# EasyEDA Pro project motoko_ice_dragon_x.eprj, schematic Schematic1

## Sheets
1 main: Board Name: Board1; Create Date: 2026-04-26; Page Name: main; Project Name: motoko_ice_dragon_x; Schematic Name: Schematic1; Update Date: 2026-04-30; Company: EasyEDA.com; Page Size: A4; Version: V1.0
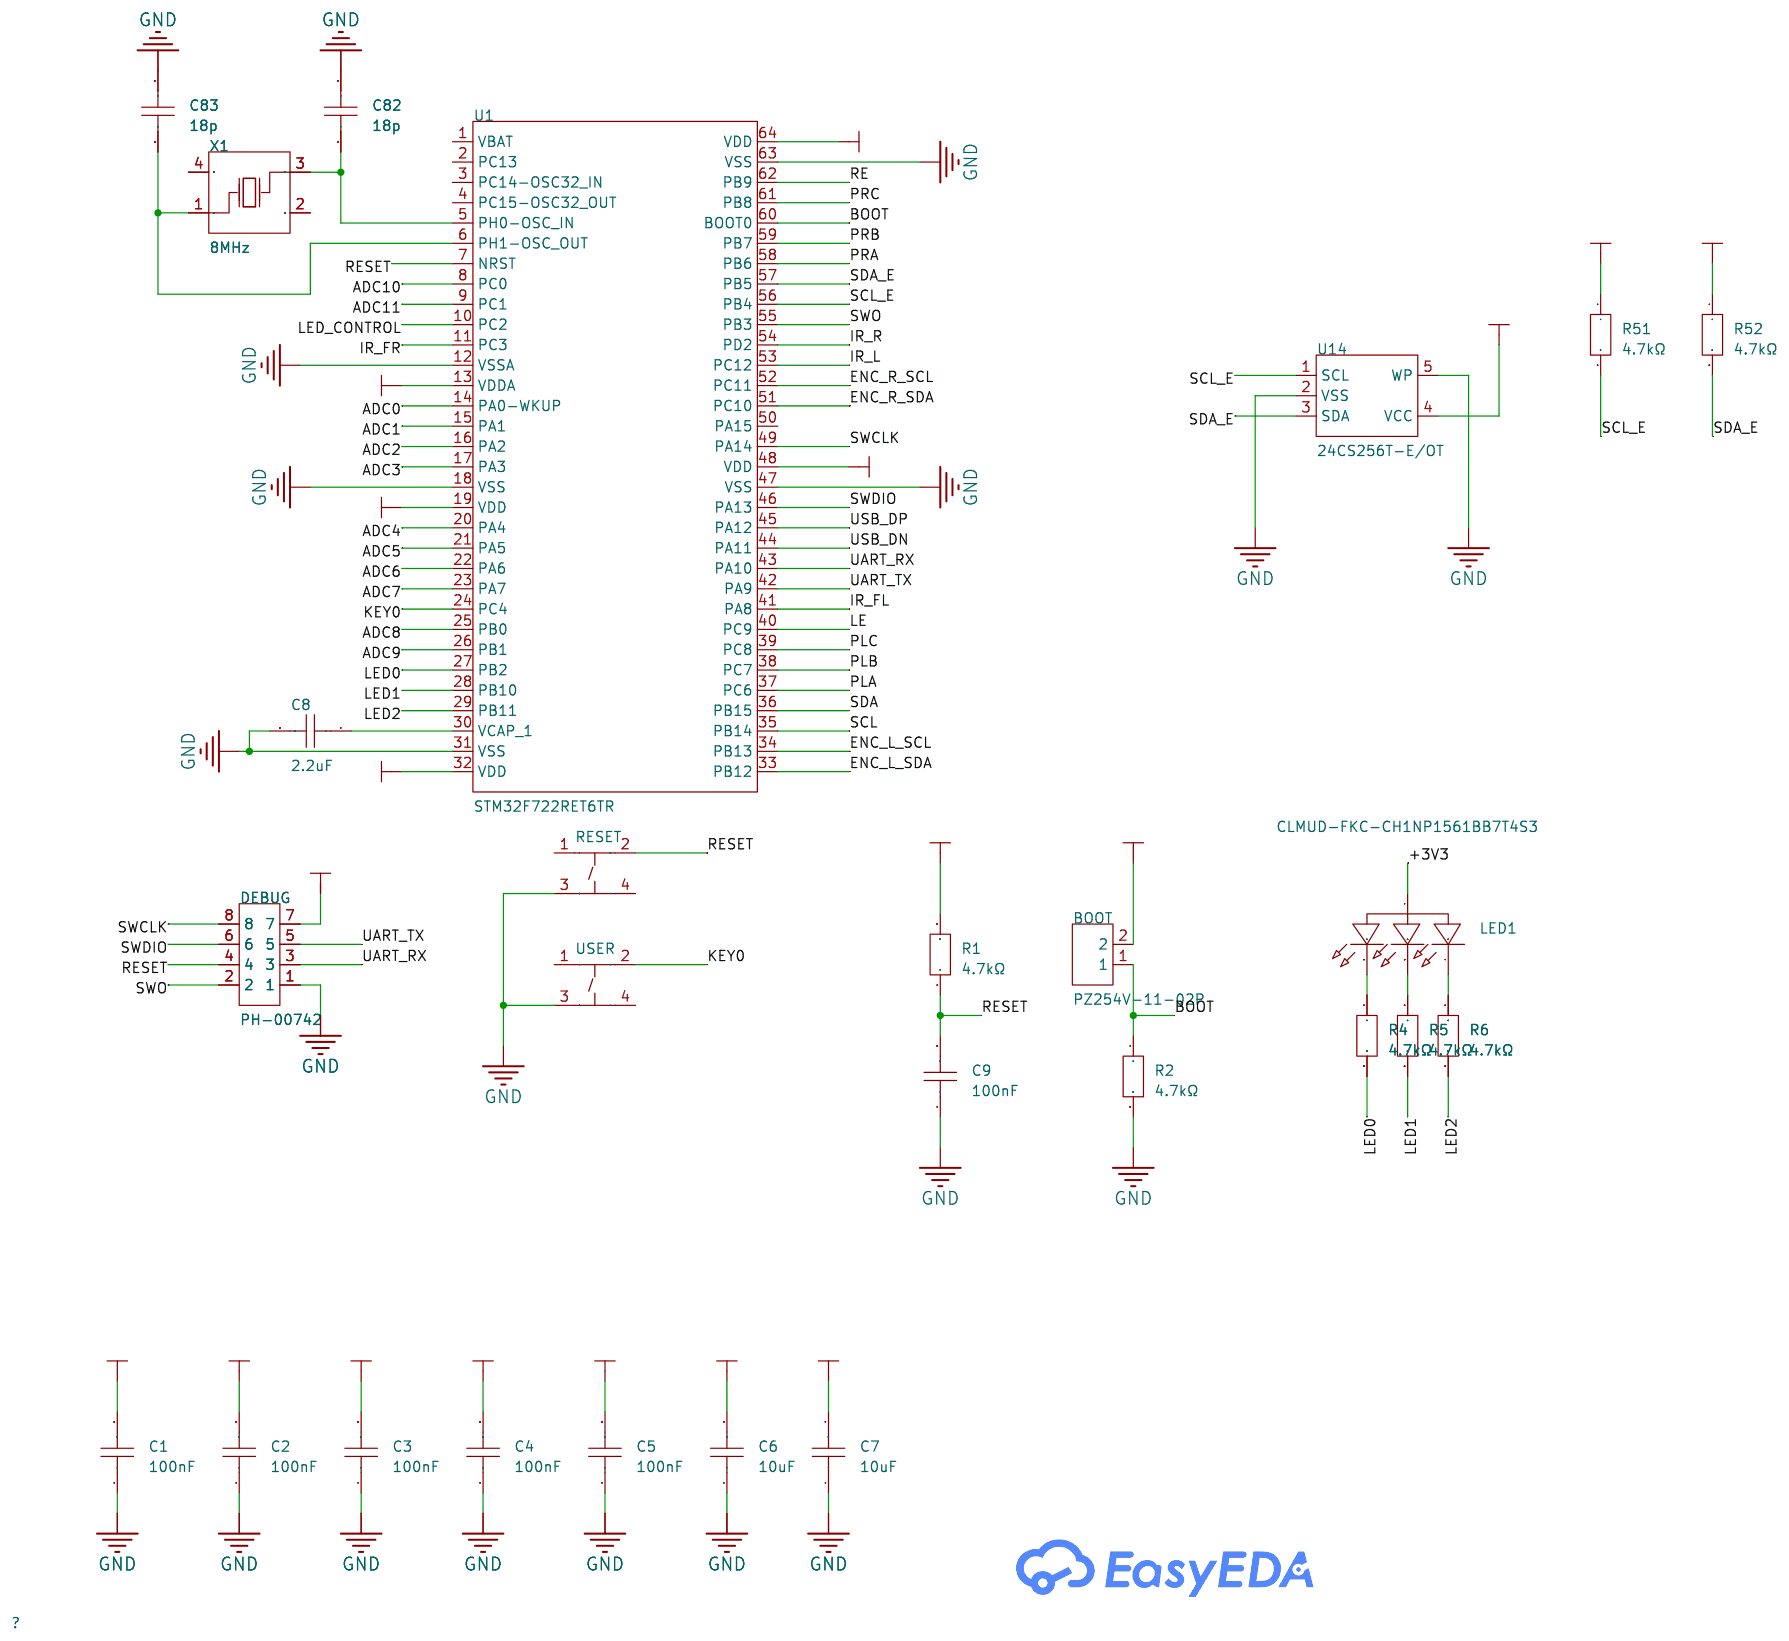
[diagram p0: main]
2 sensors: Page Name: sensors; Update Date: 2026-04-28
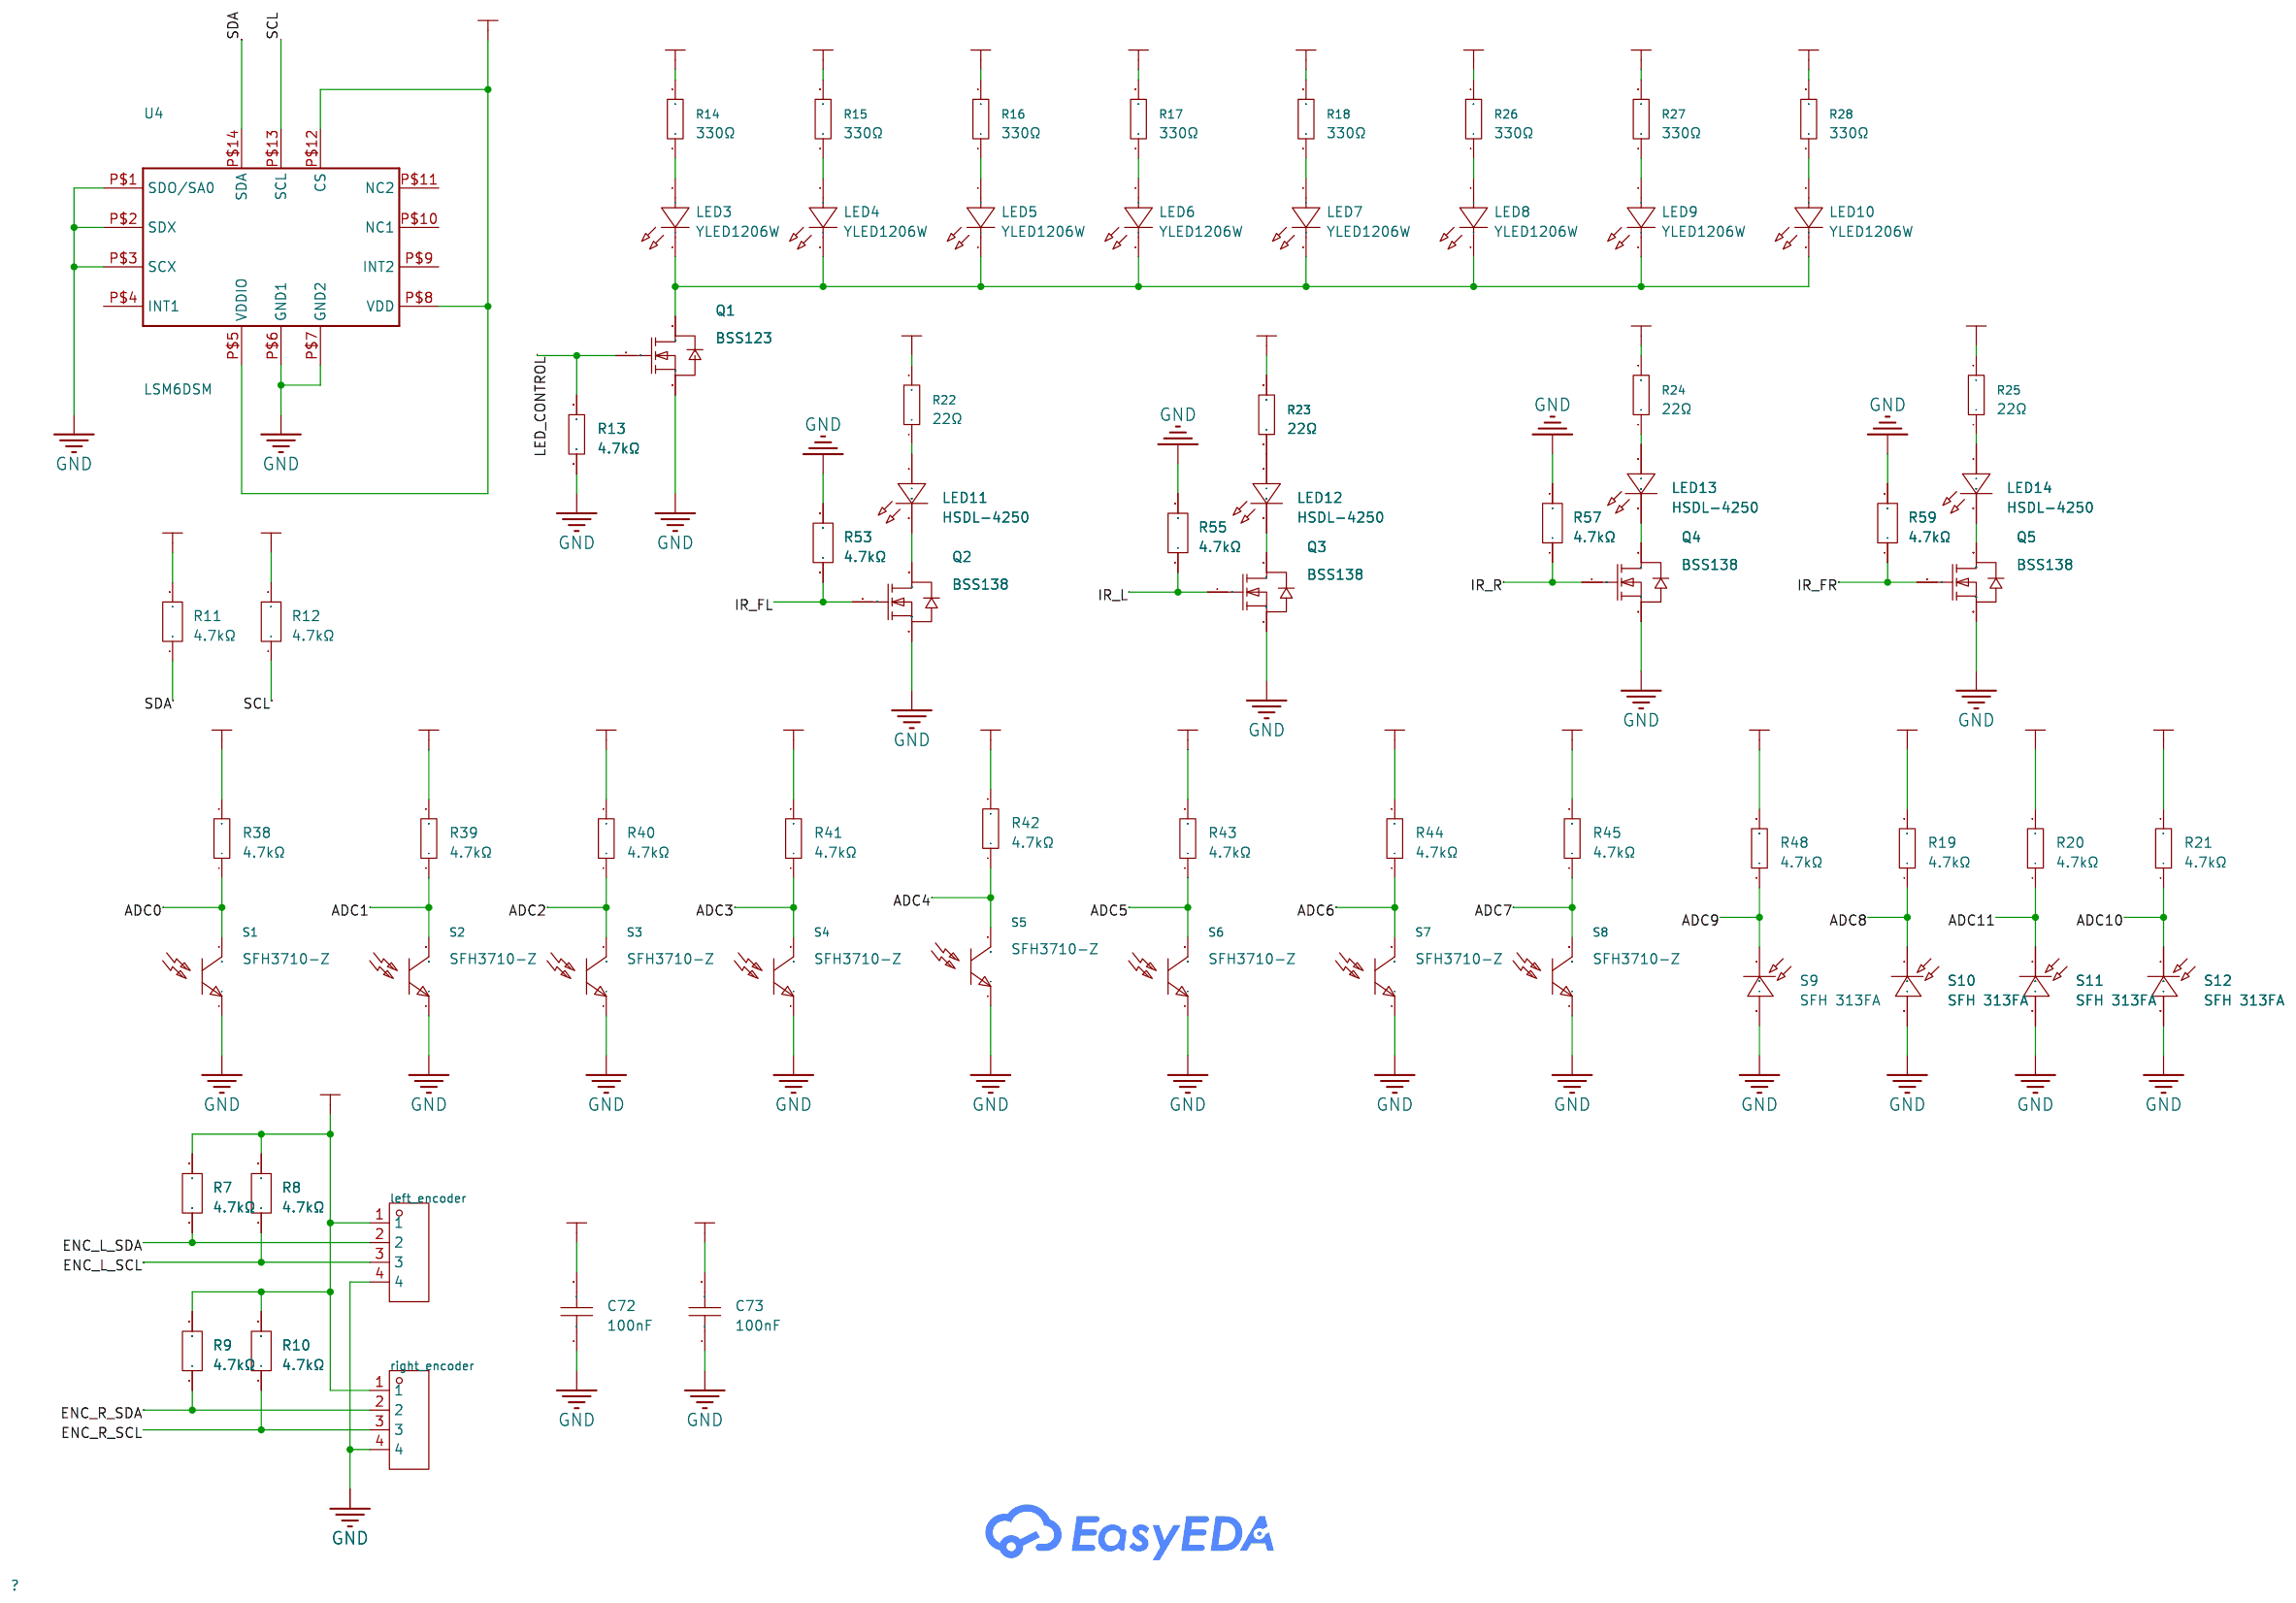
[diagram p1: sensors]
3 motors: Page Name: motors; Update Date: 2026-04-26
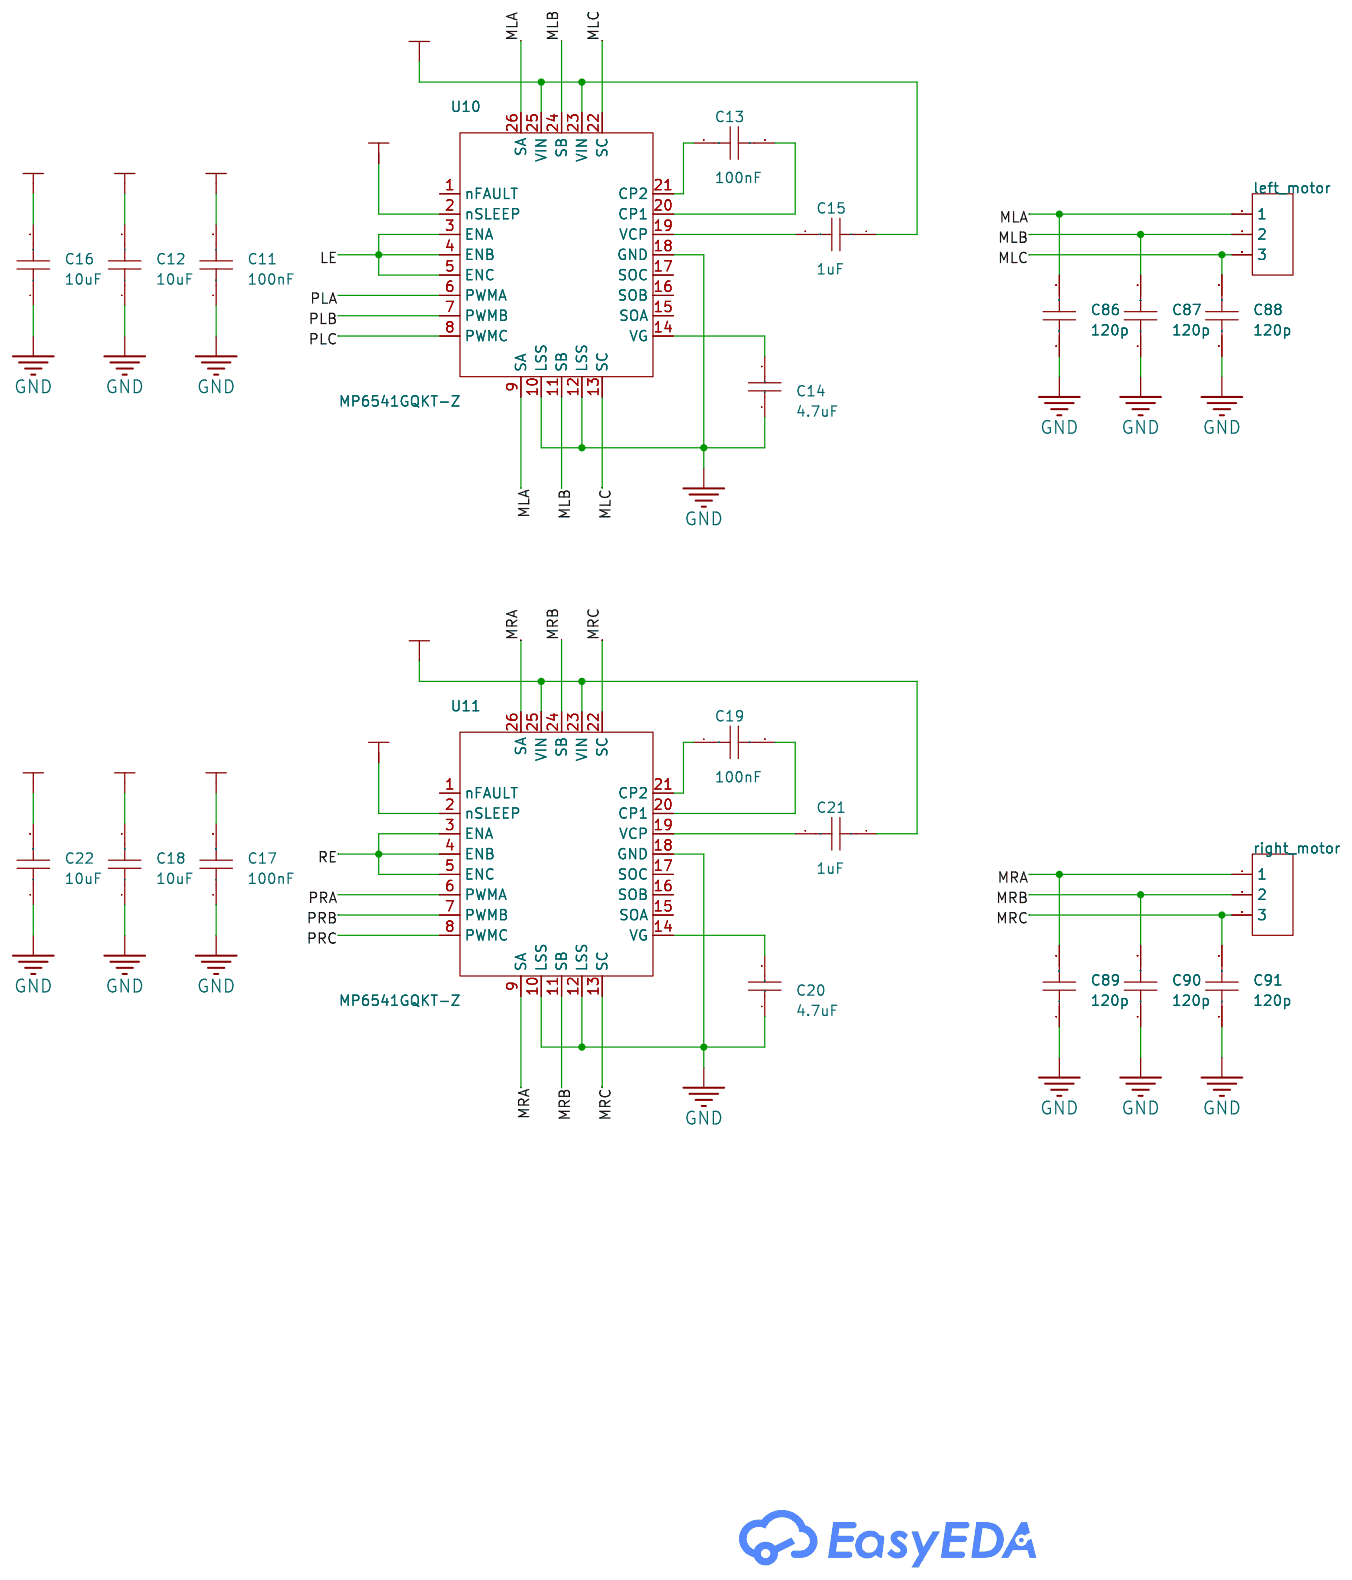
[diagram p2: motors]
4 power: Page Name: power; Update Date: 2026-04-27
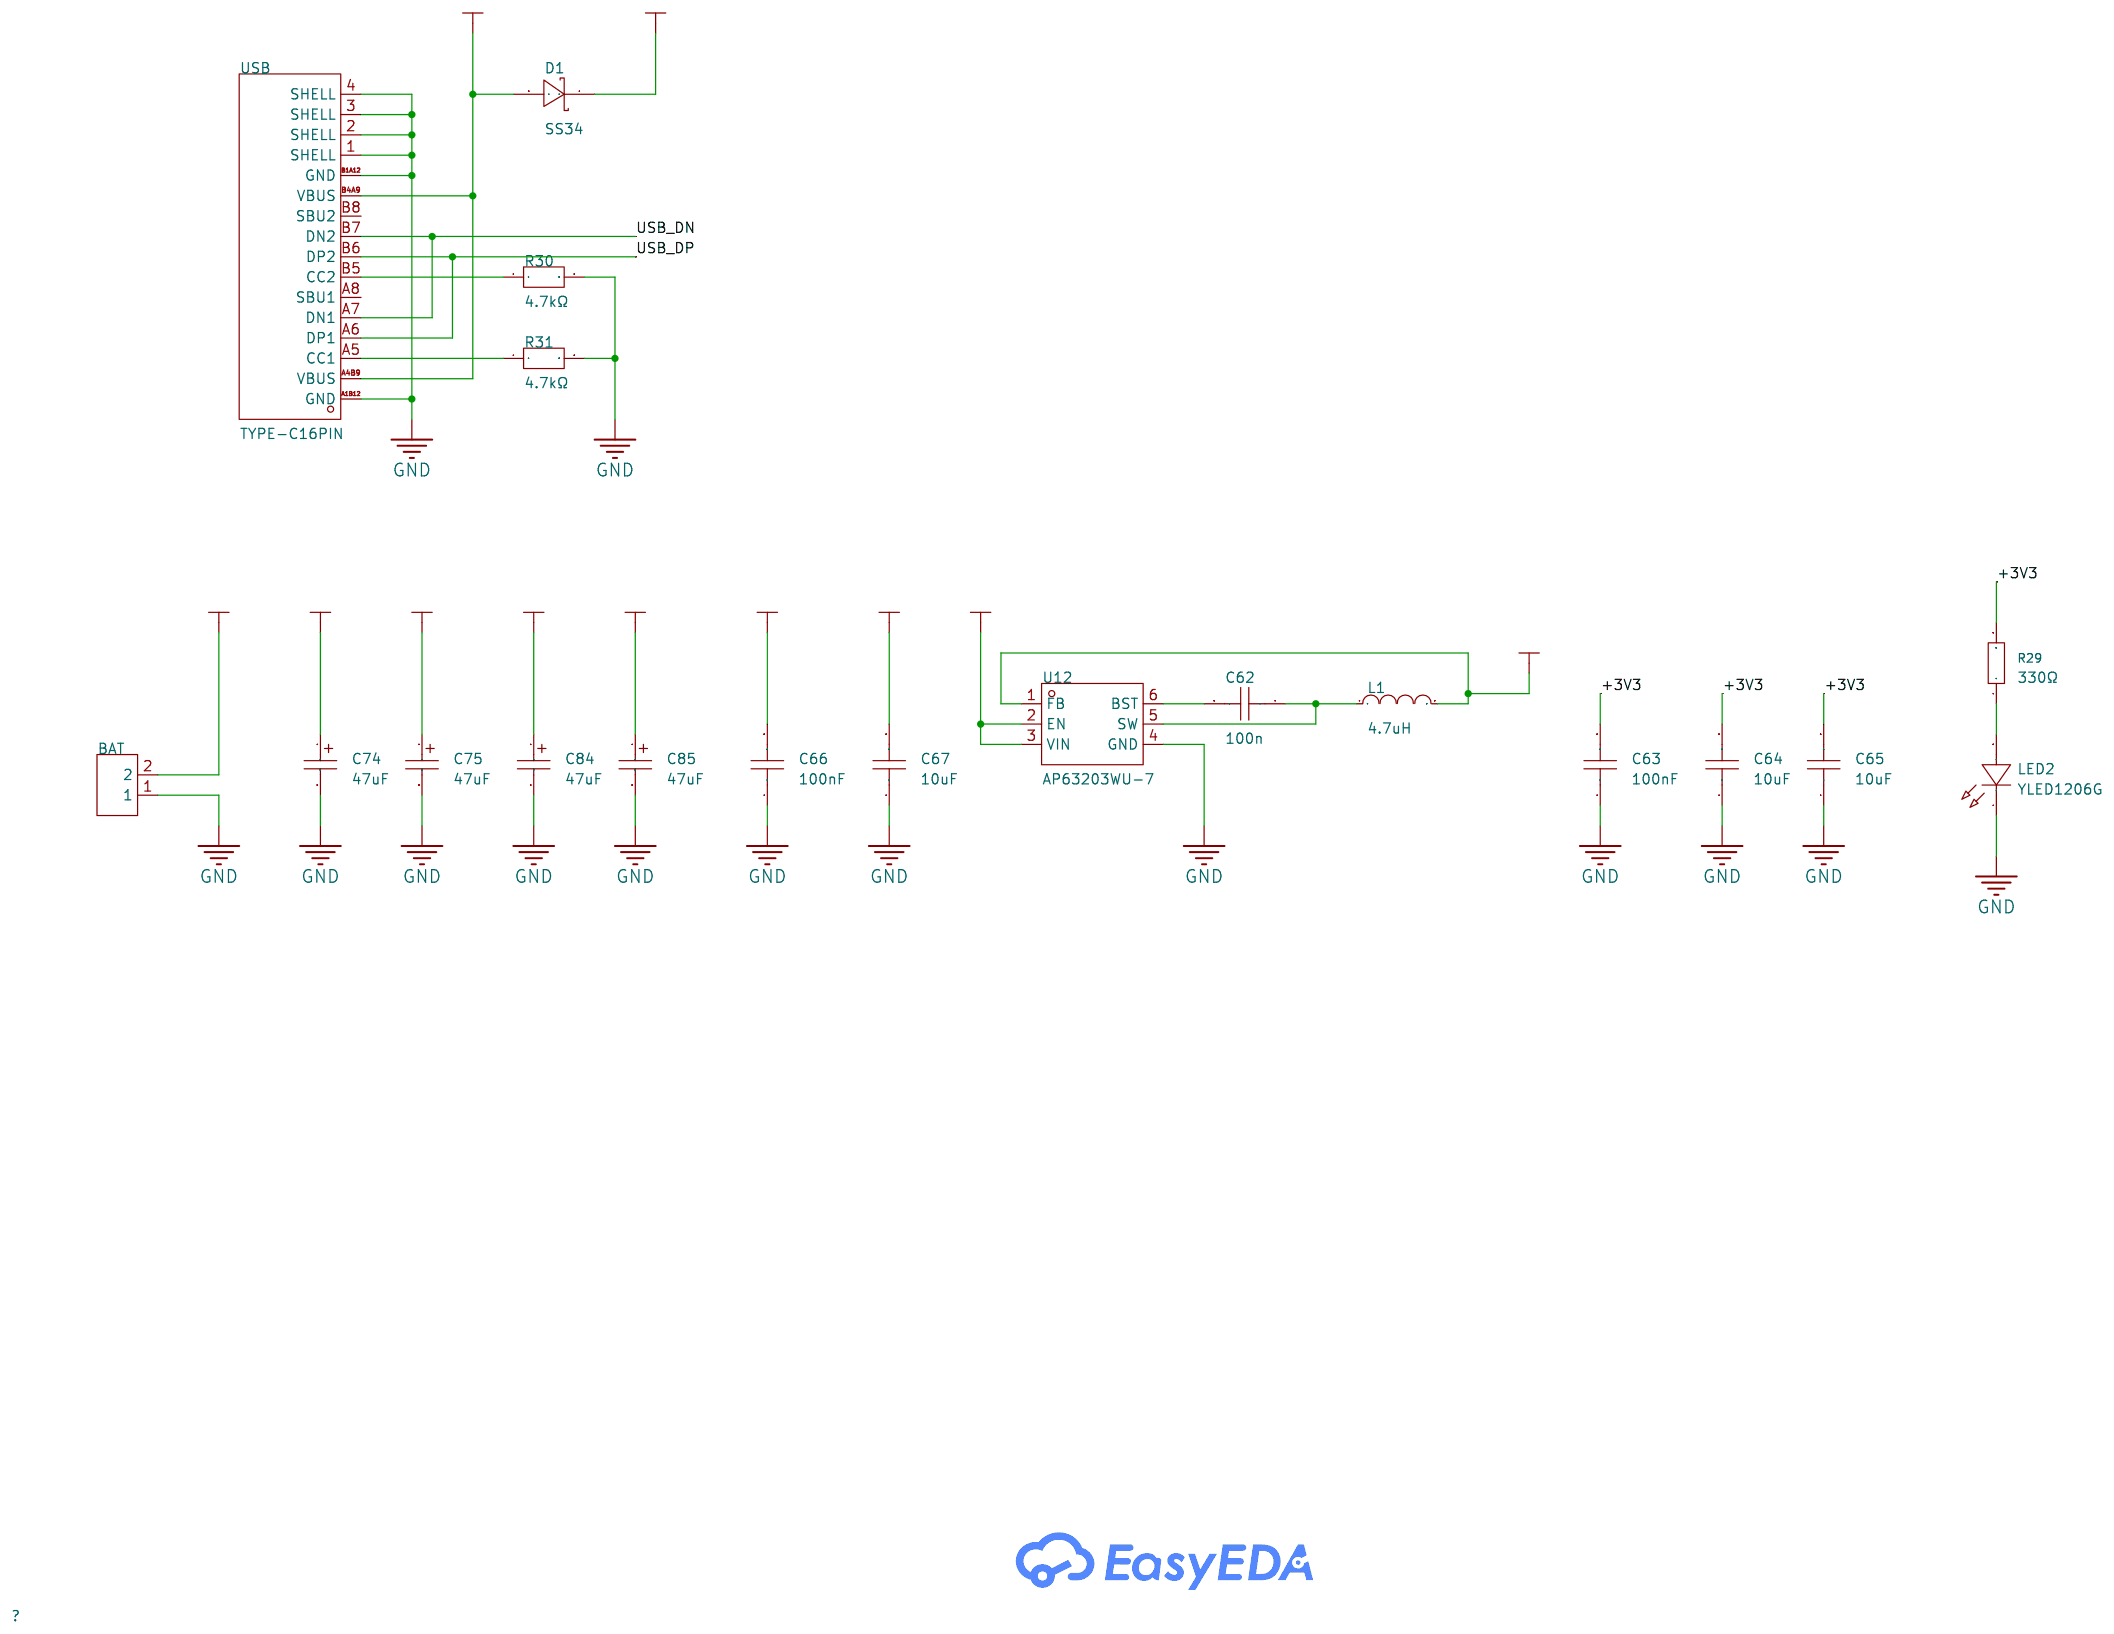
[diagram p3: power]

## Parts
sheet main
BOOT  PZ254V-11-02P  [HDR-TH_2P-P2.54-V-M]
C1  100nF  [C0805]
C2  100nF  [C0805]
C3  100nF  [C0805]
C4  100nF  [C0805]
C5  100nF  [C0805]
C6  10uF  [C0805]
C7  10uF  [C0805]
C8  2.2uF  [C0805]
C9  100nF  [C0805]
C82  18p  [C0805]
C83  18p  [C0805]
DEBUG  PH-00742  [HDR-TH_8P-P1.27-V-M-R2-C4-S1.27]
LED1  CLMUD-FKC-CH1NP1561BB7T4S3  [LED-SMD_4P-L1.5-W1.5_CLMUD-FKC-CH1NP1561BB7T4S3]
R1  4.7kΩ  [R0805]
R2  4.7kΩ  [R0805]
R4  4.7kΩ  [R0805]
R5  4.7kΩ  [R0805]
R6  4.7kΩ  [R0805]
R51  4.7kΩ  [R0805]
R52  4.7kΩ  [R0805]
RESET  TS1705-TZ60HBS  [SW-SMD_4P-L6.2-W6.2-P4.50-LS9.2-2]
U1  STM32F722RET6TR  [LQFP-64_L10.0-W10.0-P0.50-LS12.0-BL]
U14  24CS256T-E/OT  [SOT-23-5_L2.9-W1.6-P0.95-LS2.8-BR]
USER  TS1705-TZ60HBS  [SW-SMD_4P-L6.2-W6.2-P4.50-LS9.2-2]
X1  8MHz  [CRYSTAL-SMD_4P-L3.2-W2.5-BL]
sheet motors
C11  100nF  [C0805]
C12  10uF  [C0805]
C13  100nF  [C0805]
C14  4.7uF  [C0805]
C15  1uF  [C0805]
C16  10uF  [C0805]
C17  100nF  [C0805]
C18  10uF  [C0805]
C19  100nF  [C0805]
C20  4.7uF  [C0805]
C21  1uF  [C0805]
C22  10uF  [C0805]
C86  120p  [C0805]
C87  120p  [C0805]
C88  120p  [C0805]
C89  120p  [C0805]
C90  120p  [C0805]
C91  120p  [C0805]
left_motor  2.54-1*3P针  [HDR-TH_3P-P2.54-V-M-1]
right_motor  2.54-1*3P针  [HDR-TH_3P-P2.54-V-M-1]
U10  MP6541GQKT-Z  [QFN-26_L6.0-W6.0-P0.65-TL_MP6541]
U11  MP6541GQKT-Z  [QFN-26_L6.0-W6.0-P0.65-TL_MP6541]
sheet power
BAT  PZ254V-11-02P  [HDR-TH_2P-P2.54-V-M]
C62  100n  [C0805]
C63  100nF  [C0805]
C64  10uF  [C0805]
C65  10uF  [C0805]
C66  100nF  [C0805]
C67  10uF  [C0805]
C74  47uF  [CAP-SMD_L3.5-W2.8-R-RD]
C75  47uF  [CAP-SMD_L3.5-W2.8-R-RD]
C84  47uF  [CAP-SMD_L3.5-W2.8-R-RD]
C85  47uF  [CAP-SMD_L3.5-W2.8-R-RD]
D1  SS34  [SMA_L4.3-W2.6-LS5.2-RD]
L1  4.7uH  [IND-SMD_L4.0-W4.0_FNR40XXS]
LED2  YLED1206G  [LED1206-RD]
R29  330Ω  [R0805]
R30  4.7kΩ  [R0805]
R31  4.7kΩ  [R0805]
U12  AP63203WU-7  [TSOT-26_L2.9-W1.6-P0.95-LS2.8-BL]
USB  TYPE-C16PIN  [USB-C-SMD_TYPE-C16PIN]
sheet sensors
C72  100nF  [C0805]
C73  100nF  [C0805]
LED3  YLED1206W  [LED1206-R-RD]
LED4  YLED1206W  [LED1206-R-RD]
LED5  YLED1206W  [LED1206-R-RD]
LED6  YLED1206W  [LED1206-R-RD]
LED7  YLED1206W  [LED1206-R-RD]
LED8  YLED1206W  [LED1206-R-RD]
LED9  YLED1206W  [LED1206-R-RD]
LED10  YLED1206W  [LED1206-R-RD]
LED11  HSDL-4250  [LED-TH_BD5.0-P2.54-FD-1]
LED12  HSDL-4250  [LED-TH_BD5.0-P2.54-FD-1]
LED13  HSDL-4250  [LED-TH_BD5.0-P2.54-FD-1]
LED14  HSDL-4250  [LED-TH_BD5.0-P2.54-FD-1]
left_encoder  PZ254V-11-04P  [HDR-TH_4P-P2.54-V-M]
Q1  BSS123  [SOT-23-3_L3.0-W1.7-P0.95-LS2.9-BR]
Q2  BSS138  [SOT-23-3_L2.9-W1.3-P1.90-LS2.4-BR_1]
Q3  BSS138  [SOT-23-3_L2.9-W1.3-P1.90-LS2.4-BR_1]
Q4  BSS138  [SOT-23-3_L2.9-W1.3-P1.90-LS2.4-BR_1]
Q5  BSS138  [SOT-23-3_L2.9-W1.3-P1.90-LS2.4-BR_1]
R7  4.7kΩ  [R0805]
R8  4.7kΩ  [R0805]
R9  4.7kΩ  [R0805]
R10  4.7kΩ  [R0805]
R11  4.7kΩ  [R0805]
R12  4.7kΩ  [R0805]
R13  4.7kΩ  [R0805]
R14  330Ω  [R0805]
R15  330Ω  [R0805]
R16  330Ω  [R0805]
R17  330Ω  [R0805]
R18  330Ω  [R0805]
R19  4.7kΩ  [R0805]
R20  4.7kΩ  [R0805]
R21  4.7kΩ  [R0805]
R22  22Ω  [R0805]
R23  22Ω  [R0805]
R24  22Ω  [R0805]
R25  22Ω  [R0805]
R26  330Ω  [R0805]
R27  330Ω  [R0805]
R28  330Ω  [R0805]
R38  4.7kΩ  [R0805]
R39  4.7kΩ  [R0805]
R40  4.7kΩ  [R0805]
R41  4.7kΩ  [R0805]
R42  4.7kΩ  [R0805]
R43  4.7kΩ  [R0805]
R44  4.7kΩ  [R0805]
R45  4.7kΩ  [R0805]
R48  4.7kΩ  [R0805]
R53  4.7kΩ  [R0805]
R55  4.7kΩ  [R0805]
R57  4.7kΩ  [R0805]
R59  4.7kΩ  [R0805]
right_encoder  PZ254V-11-04P  [HDR-TH_4P-P2.54-V-M]
S1  SFH3710-Z  [OPTO-SMD_SFH3710-Z]
S2  SFH3710-Z  [OPTO-SMD_SFH3710-Z]
S3  SFH3710-Z  [OPTO-SMD_SFH3710-Z]
S4  SFH3710-Z  [OPTO-SMD_SFH3710-Z]
S5  SFH3710-Z  [OPTO-SMD_SFH3710-Z]
S6  SFH3710-Z  [OPTO-SMD_SFH3710-Z]
S7  SFH3710-Z  [OPTO-SMD_SFH3710-Z]
S8  SFH3710-Z  [OPTO-SMD_SFH3710-Z]
S9  SFH 313FA  [OPTO-TH_BD5.7-P2.54-D0.8]
S10  SFH 313FA  [OPTO-TH_BD5.7-P2.54-D0.8]
S11  SFH 313FA  [OPTO-TH_BD5.7-P2.54-D0.8]
S12  SFH 313FA  [OPTO-TH_BD5.7-P2.54-D0.8]
U4  LSM6DSM  [LGA14L]

## Library data of the parts
BAT BOOT = PZ254V-11-02P: Pin Structure:1x2P Pitch:2.54mm Row Spacing:- Circluar Pins/Square Pins:Pin Header Mounting Type:Through Hole Number of Rows:1 Number of Pins:2P Current Rating:- Voltage Rating (Max):- Length of Mating Pin:6mm Insulation Height:2.5mm Length of End Connect; LCSC Part Name: 1x2P 间距:2.54mm 方针 直插; Supplier Part: C492401; Manufacturer: XFCN(兴飞); Supplier Footprint: 插件,P=2.54mm; JLCPCB Part Class: Extended Part; Datasheet: https://item.szlcsc.com/datasheet/PZ254V-11-02P/502957.html; Supplier: LCSC; Pin Structure: 1x2P; Pitch: 2.54mm; Circluar Pins/Square Pins: Pin Header; Mounting Type: Through Hole; Number of Rows: 1; Number of Pins: 2P; Length of Mating Pin: 6mm; Insulation Height: 2.5mm; Length of End Connection Pin: 3mm; Contact Material: Brass; Operating Temperature: -40℃~+105℃; Color: Black
C1-C5 C9 C11 C13 C17 C19 C63 C66 C72 C73 C86-C91 = CC0805KRX7R9BB104: Capacitance:100nF Tolerance:±10% Tolerance:±10% Voltage Rating:50V Temperature Coefficient:X7R; LCSC Part Name: 100nF ±10% 50V; Supplier Part: C49678; Manufacturer: YAGEO(国巨); Supplier Footprint: 0805; JLCPCB Part Class: Basic Part; Datasheet: https://item.szlcsc.com/datasheet/CC0805KRX7R9BB104/50686.html; Supplier: LCSC; Tolerance: ±10%; Voltage Rating: 50V; Temperature Coefficient: X7R
C6 C7 C12 C16 C18 C22 C64 C65 C67 = GRM21BR61H106KE43L: Capacitance:10uF Tolerance:±10% Tolerance:±10% Voltage Rating:50V Temperature Coefficient:X5R; LCSC Part Name: 10uF ±10% 50V; Supplier Part: C440198; Manufacturer: muRata(村田); Supplier Footprint: 0805; JLCPCB Part Class: Basic Part; Datasheet: https://item.szlcsc.com/datasheet/GRM21BR61H106KE43L/439567.html; Supplier: LCSC; Tolerance: ±10%; Voltage Rating: 50V; Temperature Coefficient: X5R
C8 C82 C83 = CL21A225KBQNNNE: Capacitance:2.2uF Tolerance:±10% Tolerance:±10% Voltage Rating:50V Temperature Coefficient:X5R; LCSC Part Name: 2.2uF ±10% 50V; Supplier Part: C377773; Manufacturer: SAMSUNG(三星); Supplier Footprint: 0805; JLCPCB Part Class: Basic Part; Datasheet: https://item.szlcsc.com/datasheet/CL21A225KBQNNNE/350246.html; Supplier: LCSC; Tolerance: ±10%; Voltage Rating: 50V; Temperature Coefficient: X5R
DEBUG = PH-00742: Pin Structure:2x4P Pitch:1.27mm Row Spacing:1.27mm Circluar Pins/Square Pins:Pin Header Mounting Type:Through Hole Number of Rows:2 Number of Pins:8P Current Rating:1A Voltage Rating (Max):- Length of Mating Pin:3mm Insulation Height:2mm Length of End Con; LCSC Part Name: 2x4P 间距:1.27mm 方针 直插; Supplier Part: C2685182; Manufacturer: Liansheng(连盛); Supplier Footprint: 插件,P=1.27mm; JLCPCB Part Class: Extended Part; Datasheet: https://item.szlcsc.com/datasheet/PH-00742/2784456.html; Supplier: LCSC; Pin Structure: 2x4P; Pitch: 1.27mm; Row Spacing: 1.27mm; Circluar Pins/Square Pins: Pin Header; Mounting Type: Through Hole; Number of Rows: 2; Number of Pins: 8P; Current Rating: 1A; Length of Mating Pin: 3mm; Insulation Height: 2mm; Length of End Connection Pin: 2mm; Operating Temperature: -40℃~+105℃; Color: Black
LED1 = CLMUD-FKC-CH1NP1561BB7T4S3: Diode Configuration:Common Anode; Supplier Part: C6484743; Manufacturer: CREE LED; Supplier Footprint: PLCC-4; JLCPCB Part Class: Extended Part; Datasheet: https://item.szlcsc.com/datasheet/CLMUD-FKC-CH1NP1561BB7T4S3/7437925.html; Supplier: LCSC; Diode Configuration: Common Anode
R1 R2 R4-R12 R30 R31 R51-R53 R55 R57 R59 = FRC0805J472 TS: Type:Thick Film Resistor Resistance:4.7kΩ Tolerance:±5% Tolerance:±5% Power(Watts):125mW Voltage-Supply(Max):150V Temperature Coefficient:±100ppm/℃ Temperature Coefficient:±100ppm/℃ Operating Temperature:-55℃~+155℃ Operating Temperature:-55℃~+155℃; LCSC Part Name: 4.7kΩ ±5% 125mW 厚膜电阻; Supplier Part: C2907326; Manufacturer: FOJAN(富捷); Supplier Footprint: 0805; JLCPCB Part Class: Extended Part; Supplier: LCSC; Type: Thick Film Resistor; Tolerance: ±5%; Power(Watts): 125mW; Voltage-Supply(Max): 150V; Temperature Coefficient: ±100ppm/℃; Operating Temperature: -55℃~+155℃
RESET USER = TS1705-TZ60HBS: LCSC Part Name: 6*6*6 立贴    防水IP67 轻触开关; Supplier Part: C36936628; Manufacturer: BXCONN(宝讯); Supplier Footprint: SMD-4P,6.2x6.2mm; JLCPCB Part Class: Extended Part; Datasheet: https://item.szlcsc.com/datasheet/TS1705-TZ60HBS/38663805.html; Supplier: LCSC; Circuit: SPST; Actuator Style: Round Button; Mounting Type: Surface Mount,Vertical; Length: 6.15mm; Width: 6.15mm; Switch Height: 6mm; with Bracket: Without Bracket; Contact Current: 50mA; Voltage Rating: 12V; Actuator/Cap Color: Black; With Lamp: No; Termination Style: Gull Wing
U1 = STM32F722RET6TR: CPU Core:- CPU Maximum Speed:216MHz Program Storage Size:512KB Number of I/O:50 ADC (Bit):12bit DAC (Bit):12bit Low Voltage Detection Threshold:1.7V~3.6V Low Voltage Detection Threshold:1.7V~3.6V; LCSC Part Name: 带DSP和FPU的高性能ARM Cortex-M7 MCU，具有512 KB Flash、216 MHz CPU、ART加速器、一级缓存和SDRAM; Supplier Part: C3230927; Manufacturer: ST(意法半导体); Supplier Footprint: LQFP-64(10x10); JLCPCB Part Class: Extended Part; Datasheet: https://atta.szlcsc.com/upload/public/pdf/source/20221107/A1E77E60094A628874AD1229AC7C6782.pdf; Supplier: LCSC; CPU Maximum Speed: 216MHz; Program Storage Size: 512KB; Number of I/O: 50; ADC (Bit): 12bit; DAC (Bit): 12bit; Low Voltage Detection Threshold: 1.7V~3.6V
U14 = 24CS256T-E/OT: LCSC Part Name: 256-Kbit，3.4 MHz I²C 串行 EEPROM，带 128 位序列号和增强型软件写保护; Supplier Part: C5486872; Manufacturer: MICROCHIP(美国微芯); Supplier Footprint: SOT-23-5; JLCPCB Part Class: Extended Part; Datasheet: https://item.szlcsc.com/datasheet/24CS256T-E%252FOT/6402975.html; Supplier: LCSC; Interface: I2C; Memory Size: 256Kbit; Write Cycle Time(Tw): 5ms; Data Retention - TDR (Year): 200 Years; Write Cycle Endurance: 1,000,000 cycles; Features: Software write protection function；Built-in power-on reset (POR)；Hardware write protection function；Noise suppression function；Built-in error correction code (ECC) function; Voltage - Supply: 1.7V~5.5V; Operating Temperature: -40℃~+125℃
X1 = X322512MSB4SI: Type:Crystal Oscillator Frequency:12MHz Normal temperature Frequency Tolerance:±10ppm Normal temperature Frequency Tolerance:±10ppm Load Capacitance:20pF Frequency Stability:±20ppm Frequency Stability:±20ppm Operating Temperature:-40℃~+85℃ Operating Tempe; LCSC Part Name: YSX321SL 12MHZ 4P 3225 20PF ±10PPM -40~85℃ (±20PPM); Supplier Part: C9002; Manufacturer: YXC(扬兴晶振); Supplier Footprint: SMD3225-4P; JLCPCB Part Class: Basic Part; Datasheet: https://item.szlcsc.com/datasheet/X322512MSB4SI/9522.html; Supplier: LCSC; Type: Crystal Oscillator; Normal temperature Frequency Tolerance: ±10ppm; Load Capacitance: 20pF; Frequency Stability: ±20ppm; Operating Temperature: -40℃~+85℃
C14 C20 = CL21A475KAQNNNE: Capacitance:4.7uF Tolerance:±10% Tolerance:±10% Voltage Rating:25V Temperature Coefficient:X5R; LCSC Part Name: 4.7uF ±10% 25V; Supplier Part: C1779; Manufacturer: SAMSUNG(三星); Supplier Footprint: 0805; JLCPCB Part Class: Basic Part; Datasheet: https://item.szlcsc.com/datasheet/CL21A475KAQNNNE/2131.html; Supplier: LCSC; Tolerance: ±10%; Voltage Rating: 25V; Temperature Coefficient: X5R
C15 C21 = TCC0805X7R105M500FT: Capacitance:1uF Tolerance:±20% Tolerance:±20% Voltage Rating:50V Temperature Coefficient:X7R; LCSC Part Name: 1uF ±20% 50V; Supplier Part: C376929; Manufacturer: CCTC(三环); Supplier Footprint: 0805; JLCPCB Part Class: Extended Part; Datasheet: https://item.szlcsc.com/datasheet/TCC0805X7R105M500FT/349288.html; Supplier: LCSC; Tolerance: ±20%; Voltage Rating: 50V; Temperature Coefficient: X7R
left_motor right_motor = 2.54-1*3P针: Pin Structure:1x3P Pitch:2.54mm Row Spacing:- Circluar Pins/Square Pins:Pin Header Mounting Type:Through Hole Number of Rows:1 Number of Pins:3P Current Rating:3A Voltage Rating (Max):- Length of Mating Pin:6mm Insulation Height:2.5mm Length of End Connec; LCSC Part Name: 1x3P 间距:2.54mm 方针 直插; Supplier Part: C49257; Manufacturer: BOOMELE(博穆精密); Supplier Footprint: 插件,P=2.54mm; JLCPCB Part Class: Extended Part; Datasheet: https://item.szlcsc.com/datasheet/2.54-1*3P%25E9%2592%2588/50265.html; Supplier: LCSC; Pin Structure: 1x3P; Pitch: 2.54mm; Circluar Pins/Square Pins: Pin Header; Mounting Type: Through Hole; Number of Rows: 1; Number of Pins: 3P; Current Rating: 3A; Length of Mating Pin: 6mm; Insulation Height: 2.5mm; Length of End Connection Pin: 3mm; Contact Material: Brass; Contact Plating: Gold; Operating Temperature: -40℃~+105℃; Color: Black
U10 U11 = MP6541GQKT-Z: Drive Type:Three Phase Integrated FETs:Yes Number of Half Bridges:3 Output Current:8A Output Current:8A Peak Current:12A Voltage - Supply:4.75V~40V Voltage - Supply:4.75V~40V Quiescent Current(Iq):4mA Operating Temperature:-40℃~+125℃ Operating Temperature; LCSC Part Name: 40V、8A三相功率级; Supplier Part: C19089145; Manufacturer: MPS(芯源); Supplier Footprint: TQFN-26(6x6); JLCPCB Part Class: Extended Part; Datasheet: https://item.szlcsc.com/datasheet/MP6541GQKT-Z/20295232.html; Supplier: LCSC; Drive Type: Three Phase; Integrated FETs: Yes; Number of Half Bridges: 3; Output Current: 8A; Peak Current: 12A; Voltage - Supply: 4.75V~40V; Quiescent Current(Iq): 4mA; Operating Temperature: -40℃~+125℃
C62 = CL21A106KAYNNNE_C15850: Capacitance:10uF Tolerance:±10% Tolerance:±10% Voltage Rating:25V Temperature Coefficient:X5R; LCSC Part Name: 10uF ±10% 25V; Supplier Part: C15850; Manufacturer: SAMSUNG(三星); Manufacturer Part: CL21A106KAYNNNE; Supplier Footprint: 0805; JLCPCB Part Class: Basic Part; Datasheet: https://item.szlcsc.com/datasheet/CL21A106KAYNNNE/16532.html; Supplier: LCSC; Tolerance: ±10%; Voltage Rating: 25V; Temperature Coefficient: X5R
C74 C75 C84 C85 = CA45-B010K476T: Capacitance:47uF Tolerance:±10% Tolerance:±10% Voltage Rating:10V Equivalent Series Resistance(ESR):1Ω@100kHz Operating Temperature:-55℃~+125℃ Operating Temperature:-55℃~+125℃; LCSC Part Name: 47uF ±10% 10V; Supplier Part: C123253; Manufacturer: 湘怡中元/湘江; Supplier Footprint: CASE-B-3528-19(mm); JLCPCB Part Class: Extended Part; Datasheet: https://item.szlcsc.com/datasheet/CA45-B010K476T/124523.html; Supplier: LCSC; Tolerance: ±10%; Voltage Rating: 10V; Equivalent Series Resistance(ESR): 1Ω@100kHz; Operating Temperature: -55℃~+125℃
D1 = SS34_C8678: Diode Configuration:Independent Voltage - Forward(Vf@If):550mV@3A Voltage - DC Reverse(Vr):40V Current - Rectified:3A Reverse Leakage Current (Ir):500uA@40V Operating Junction Temperature Range:-55℃~+125℃ Operating Junction Temperature Range:-55℃~+125℃; LCSC Part Name: 电压:40V 电流:3A; Supplier Part: C8678; Manufacturer: MDD(辰达半导体); Supplier Footprint: SMA(DO-214AC); JLCPCB Part Class: Basic Part; Datasheet: https://item.szlcsc.com/datasheet/SS34/9178.html; Supplier: LCSC; Diode Configuration: Independent; Voltage - Forward(Vf@If): 550mV@3A; Voltage - DC Reverse(Vr): 40V; Current - Rectified: 3A; Reverse Leakage Current (Ir): 500uA@40V; Operating Junction Temperature Range: -55℃~+125℃
L1 = FNR4030S4R7MT: Inductance:4.7uH Tolerance:±20% Tolerance:±20% Current Rating:2.3A Current - Saturation(Isat):3.2A DC Resistance(DCR):78mΩ Type:Magnetic Core Shielded Winding Alloy Inductor; LCSC Part Name: 4.7uH ±20% 3.2A; Supplier Part: C167874; Manufacturer: cjiang(长江微电); Supplier Footprint: SMD,4x4mm; JLCPCB Part Class: Extended Part; Datasheet: https://atta.szlcsc.com/upload/public/pdf/source/20190327/C167925_9EFF0AABC4CA629C2CC95961DBF7D39D.pdf; Supplier: LCSC; Tolerance: ±20%; Current Rating: 2.3A; Current - Saturation(Isat): 3.2A; DC Resistance(DCR): 78mΩ; Type: Magnetic Core Shielded Winding Alloy Inductor
LED2 = YLED1206G: Lamp Holder Type:- Illumination Color:Emerald Green Voltage - Forward(Vf):2.4V~3.1V Voltage - Forward(Vf):2.4V~3.1V Power(Watts):100mW Forward Current:20mA Wavelength - Dominant:516nm~531nm Wavelength - Dominant:516nm~531nm Peak Wavelength:525nm Diode Con; LCSC Part Name: 发光管; Supplier Part: C30584801; Manufacturer: YONGYUTAI(永裕泰); Supplier Footprint: 1206; JLCPCB Part Class: Extended Part; Datasheet: https://item.szlcsc.com/datasheet/YLED1206G/32319013.html; Supplier: LCSC; Illumination Color: Emerald Green; Voltage - Forward(Vf): 2.4V~3.1V; Power(Watts): 100mW; Forward Current: 20mA; Wavelength - Dominant: 516nm~531nm; Peak Wavelength: 525nm; Luminous Intensity: 620mcd; Viewing Angle: 120°; Operating Temperature: -40℃~+85℃
R14-R18 R22-R29 = 0805W8F3300T5E: Type:Thick Film Resistor Resistance:330Ω Tolerance:±1% Tolerance:±1% Power(Watts):125mW Voltage-Supply(Max):150V Temperature Coefficient:±100ppm/℃ Temperature Coefficient:±100ppm/℃ Operating Temperature:-55℃~+155℃ Operating Temperature:-55℃~+155℃; LCSC Part Name: 330Ω ±1% 125mW 厚膜电阻; Supplier Part: C17630; Manufacturer: UNI-ROYAL(厚声); Supplier Footprint: 0805; JLCPCB Part Class: Basic Part; Datasheet: https://item.szlcsc.com/datasheet/0805W8F3300T5E/18318.html; Supplier: LCSC; Type: Thick Film Resistor; Tolerance: ±1%; Power(Watts): 125mW; Voltage-Supply(Max): 150V; Temperature Coefficient: ±100ppm/℃; Operating Temperature: -55℃~+155℃
U12 = AP63203WU-7: Function:Buck Voltage - Supply:3.8V~32V Voltage - Supply:3.8V~32V Output Voltage:3.3V Output Voltage:3.3V Output Current:2A Frequency - Switching:1.1MHz Frequency - Switching:1.1MHz Operating Temperature:-40℃~+85℃@(TA) Operating Temperature:-40℃~+85℃@(TA); LCSC Part Name: 3.8V至32V输入、2A低静态电流同步降压转换器，增强EMI抑制; Supplier Part: C780769; Manufacturer: DIODES(美台); Supplier Footprint: TSOT-23-6; JLCPCB Part Class: Extended Part; Datasheet: https://item.szlcsc.com/datasheet/AP63203WU-7/832852.html; Supplier: LCSC; Function: Buck; Voltage - Supply: 3.8V~32V; Output Voltage: 3.3V; Output Current: 2A; Frequency - Switching: 1.1MHz; Operating Temperature: -40℃~+85℃@(TA); Synchronous Rectifier: Yes; Number of Outputs: 1; Topology: Buck; Quiescent Current: 22uA; Switch tube (built-in/external): Built-In; Output Type: Fixed
USB = TYPE-C16PIN: Connector Type:Type-C Protocol Standard:USB 3.1 Gender:Female Mounting Type:Surface Mount, Right Angle Number of Contacts:16P Number of Ports:1 Current Rating-Power:3A Voltage Rating:30V Connect-Disconnect Life:10,000 Cycles Detection color:Black Operatin; LCSC Part Name: Type-C 母 卧贴; Supplier Part: C393939; Manufacturer: SHOU HAN(首韩); Supplier Footprint: SMD; JLCPCB Part Class: Extended Part; Datasheet: https://item.szlcsc.com/datasheet/TYPE-C16PIN/372551.html; Supplier: LCSC; Connector Type: Type-C; Protocol Standard: USB 3.1; Gender: Female; Mounting Type: Surface Mount, Right Angle; Number of Contacts: 16P; Number of Ports: 1; Current Rating-Power: 3A; Voltage Rating: 30V; Connect-Disconnect Life: 10,000 Cycles; Detection color: Black; Operating Temperature: -40℃~+85℃
LED3-LED10 = YLED1206W: Lamp Holder Type:- Illumination Color:White Voltage - Forward(Vf):2.6V~3.1V Voltage - Forward(Vf):2.6V~3.1V Power(Watts):70mW Forward Current:20mA Wavelength - Dominant:- Wavelength - Dominant:- Peak Wavelength:- Diode Configuration:- Lens Color:- Color T; LCSC Part Name: 发光管; Supplier Part: C28310437; Manufacturer: YONGYUTAI(永裕泰); Supplier Footprint: 1206; JLCPCB Part Class: Extended Part; Datasheet: https://item.szlcsc.com/datasheet/YLED1206W/30046764.html; Supplier: LCSC; Illumination Color: White; Voltage - Forward(Vf): 2.6V~3.1V; Power(Watts): 70mW; Forward Current: 20mA; Color Temperature: 13969K~100000K; Luminous Intensity: 175mcd~430mcd; Viewing Angle: 120°; Operating Temperature: -40℃~+85℃
LED11-LED14 = HSDL-4250: Voltage - Forward(Vf):1.4V Voltage - Forward(Vf):1.4V Wavelength:870nm Wavelength:870nm Radiant Intensity:124mW/sr@100mA Operating Temperature:-40℃~+85℃ Operating Temperature:-40℃~+85℃; Supplier Part: C5730862; Manufacturer: LITEON(光宝); JLCPCB Part Class: Extended Part; Datasheet: https://item.szlcsc.com/datasheet/HSDL-4250/6656316.html; Supplier: LCSC; Voltage - Forward(Vf): 1.4V; Wavelength: 870nm; Radiant Intensity: 124mW/sr@100mA; Operating Temperature: -40℃~+85℃
left_encoder right_encoder = PZ254V-11-04P: Pin Structure:1x4P Pitch:2.54mm Row Spacing:- Circluar Pins/Square Pins:Pin Header Mounting Type:Through Hole Number of Rows:1 Number of Pins:4P Current Rating:3A Voltage Rating (Max):250V Length of Mating Pin:6mm Insulation Height:2.5mm Length of End Con; LCSC Part Name: 1x4P 间距:2.54mm 方针 直插; Supplier Part: C2691448; Manufacturer: XFCN(兴飞); Supplier Footprint: 插件,P=2.54mm; JLCPCB Part Class: Extended Part; Datasheet: https://item.szlcsc.com/datasheet/PZ254V-11-04P/2801085.html; Supplier: LCSC; Pin Structure: 1x4P; Pitch: 2.54mm; Circluar Pins/Square Pins: Pin Header; Mounting Type: Through Hole; Number of Rows: 1; Number of Pins: 4P; Current Rating: 3A; Voltage Rating (Max): 250V; Length of Mating Pin: 6mm; Insulation Height: 2.5mm; Length of End Connection Pin: 3mm; Operating Temperature: -40℃~+105℃; Color: Black
Q1 = BSS123_2: Number:- Drain to Source Voltage:100V Current - Continuous Drain(Id):170mA RDS(on):4.3Ω@4.5V,200mA Pd - Power Dissipation:350mW Gate Threshold Voltage (Vgs(th)@Id):2.5V Gate Charge(Qg):2nC@10V Input Capacitance(Ciss):60pF Reverse Transfer Capacitance (Crs; LCSC Part Name: N沟道,电流:170mA,耐压:100V; Supplier Part: C41355122; Manufacturer: Siliup(矽普); Supplier Footprint: SOT-23; Datasheet: https://atta.szlcsc.com/upload/public/pdf/source/20240815/F5B63F8FE9D005365415E1A86BED304A.pdf; Supplier: LCSC; Drain to Source Voltage: 100V; Current - Continuous Drain(Id): 170mA; RDS(on): 4.3Ω@4.5V,200mA; Pd - Power Dissipation: 350mW; Gate Threshold Voltage (Vgs(th)@Id): 2.5V; Gate Charge(Qg): 2nC@10V; Input Capacitance(Ciss): 60pF; Reverse Transfer Capacitance (Crss@Vds): 6pF; Operating Temperature: -55℃~+150℃
Q2-Q5 = BSS138_C51898309: Supplier Part: C51898309; Manufacturer: baocheng(宝乘); Supplier Footprint: SOT-23; JLCPCB Part Class: Extended Part; Datasheet: https://item.szlcsc.com/datasheet/BSS138/54583734.html; Supplier: LCSC
R13 R19-R21 R38-R45 R48 = 0805W8F4701T5E: Type:Thick Film Resistors Resistance:4.7kΩ Tolerance:±1% Tolerance:±1% Power(Watts): Overload Voltage (Max): Temperature Coefficient:±100ppm/℃ Temperature Coefficient:±100ppm/℃ Operating Temperature Range:-55℃~+155℃ Operating Temperature Range:-55℃~+155℃; LCSC Part Name: 4.7kΩ ±1% 125mW 厚膜电阻; Supplier Part: C17673; Manufacturer: UNI-ROYAL(厚声); Supplier Footprint: 0805; JLCPCB Part Class: Basic Part; Datasheet: https://atta.szlcsc.com/upload/public/pdf/source/20200306/C422600_1E6D84923E4A46A82E41ADD87F860B5C.pdf; Supplier: LCSC; Type: Thick Film Resistors; Tolerance: ±1%; Temperature Coefficient: ±100ppm/℃; Operating Temperature Range: -55℃~+155℃
S1-S8 = SFH3710-Z: type:NPN Collector - Emitter Voltage VCEO:5.5V Collector - Emitter Voltage VCEO:5.5V Current - Collector(Ic):20mA Dissipation Power(Max):- Current - Dark(Id):3nA Peak Wavelength:570nm Viewing Angle:±60° Operating Temperature:-40℃~+85℃ Operating Temperatur; LCSC Part Name: 570nm光电三极管; Supplier Part: C129152; Manufacturer: OSRAM(欧司朗); Supplier Footprint: SMD,3.2x1.3mm; JLCPCB Part Class: Extended Part; Datasheet: https://item.szlcsc.com/datasheet/SFH3710-Z/140438.html; Supplier: LCSC; type: NPN; Collector - Emitter Voltage VCEO: 5.5V; Current - Collector(Ic): 20mA; Current - Dark(Id): 3nA; Peak Wavelength: 570nm; Viewing Angle: ±60°; Operating Temperature: -40℃~+85℃
S9-S12 = SFH 313FA: Collector Emitter Voltage:70V Collector Emitter Voltage:70V Collector Current (Ic):50mA Dissipation Power(Max):200mW Collector Dark Current:200nA Peak Wavelength:870nm Viewing Angle:- Operating Temperature:-40℃~+100℃ Operating Temperature:-40℃~+100℃; Supplier Part: C3210896; Manufacturer: OSRAM(欧司朗); Supplier Footprint: 插件; JLCPCB Part Class: Extended Part; Supplier: LCSC; Collector Emitter Voltage: 70V; Collector Current (Ic): 50mA; Dissipation Power(Max): 200mW; Collector Dark Current: 200nA; Peak Wavelength: 870nm; Operating Temperature: -40℃~+100℃
U4 = LSM6DSM

## Nets
+3V3: BOOT.2 C1.2 C2.2 C3.2 C4.2 C5.2 C6.2 C7.2 C63.2 C64.2 C65.2 C72.2 C73.2 DEBUG.7 L1.2 LED1.1(A) left_encoder.1 R1.2 R7.2 R8.2 R9.2 R10.2 R11.2 R12.2 R14.2 R15.2 R16.2 R17.2 R18.2 R19.2 R20.2 R21.2 R22.2 R23.2 R24.2 R25.2 R26.2 R27.2 R28.2 R29.2 R38.2 R39.2 R40.2 R41.2 R42.2 R43.2 R44.2 R45.2 R48.2 R51.1 R52.1 right_encoder.1 U1.13(VDDA) U1.19(VDD) U1.32(VDD) U1.48(VDD) U1.64(VDD) U4.P$5(VDDIO) U4.P$8(VDD) U4.P$12(CS) U10.2(nSLEEP) U11.2(nSLEEP) U12.1(FB) U14.4(VCC)
GND: BAT.1 C1.1 C2.1 C3.1 C4.1 C5.1 C6.1 C7.1 C8.2 C9.1 C11.1 C12.1 C14.1 C16.1 C17.1 C18.1 C20.1 C22.1 C63.1 C64.1 C65.1 C66.1 C67.1 C72.1 C73.1 C74.2 C75.2 C82.1 C83.1 C84.2 C85.2 C86.1 C87.1 C88.1 C89.1 C90.1 C91.1 DEBUG.1 LED2.1(K) left_encoder.4 Q1.2(S) Q2.2(S) Q3.2(S) Q4.2(S) Q5.2(S) R2.2 R13.1 R30.2 R31.2 R53.2 R55.2 R57.2 R59.2 RESET.3 right_encoder.4 S1.1(E) S2.1(E) S3.1(E) S4.1(E) S5.1(E) S6.1(E) S7.1(E) S8.1(E) S9.2(A) S10.2(A) S11.2(A) S12.2(A) U1.12(VSSA) U1.18(VSS) U1.31(VSS) U1.47(VSS) U1.63(VSS) U4.P$1(SDO/SA0) U4.P$2(SDX) U4.P$3(SCX) U4.P$6(GND1) U4.P$7(GND2) U10.10(LSS) U10.12(LSS) U10.18(GND) U11.10(LSS) U11.12(LSS) U11.18(GND) U12.4(GND) U14.2(VSS) U14.5(WP) USB.1(SHELL) USB.2(SHELL) USB.3(SHELL) USB.4(SHELL) USB.A1B12(GND) USB.B1A12(GND) USER.3
VBAT: BAT.2 C11.2 C12.2 C15.1 C16.2 C17.2 C18.2 C21.1 C22.2 C66.2 C67.2 C74.1 C75.1 C84.1 C85.1 D1.1(K) U10.23(VIN) U10.25(VIN) U11.23(VIN) U11.25(VIN) U12.2(EN) U12.3(VIN)
VBUS: D1.2(A) USB.A4B9(VBUS) USB.B4A9(VBUS)
ADC0: R38.1 S1.2(C) U1.14(PA0-WKUP)
ADC1: R39.1 S2.2(C) U1.15(PA1)
ADC2: R40.1 S3.2(C) U1.16(PA2)
ADC3: R41.1 S4.2(C) U1.17(PA3)
ADC4: R42.1 S5.2(C) U1.20(PA4)
ADC5: R43.1 S6.2(C) U1.21(PA5)
ADC6: R44.1 S7.2(C) U1.22(PA6)
ADC7: R45.1 S8.2(C) U1.23(PA7)
ADC8: R19.1 S10.1(C) U1.25(PB0)
ADC9: R48.1 S9.1(C) U1.26(PB1)
ADC10: R21.1 S12.1(C) U1.8(PC0)
ADC11: R20.1 S11.1(C) U1.9(PC1)
BOOT: BOOT.1 R2.1 U1.60(BOOT0)
ENC_L_SCL: left_encoder.3 R8.1 U1.34(PB13)
ENC_L_SDA: left_encoder.2 R7.1 U1.33(PB12)
ENC_R_SCL: R10.1 right_encoder.3 U1.52(PC11)
ENC_R_SDA: R9.1 right_encoder.2 U1.51(PC10)
IR_FL: Q2.1(G) R53.1 U1.41(PA8)
IR_FR: Q5.1(G) R59.1 U1.11(PC3)
IR_L: Q3.1(G) R55.1 U1.53(PC12)
IR_R: Q4.1(G) R57.1 U1.54(PD2)
KEY0: U1.24(PC4) USER.2
LE: U1.40(PC9) U10.3(ENA) U10.4(ENB) U10.5(ENC)
LED0: R4.2 U1.27(PB2)
LED1: R5.2 U1.28(PB10)
LED2: R6.2 U1.29(PB11)
LED_CONTROL: Q1.1(G) R13.2 U1.10(PC2)
MLA: C86.2 left_motor.1 U10.9(SA) U10.26(SA)
MLB: C87.2 left_motor.2 U10.11(SB) U10.24(SB)
MLC: C88.2 left_motor.3 U10.13(SC) U10.22(SC)
MRA: C89.2 right_motor.1 U11.9(SA) U11.26(SA)
MRB: C90.2 right_motor.2 U11.11(SB) U11.24(SB)
MRC: C91.2 right_motor.3 U11.13(SC) U11.22(SC)
PLA: U1.37(PC6) U10.6(PWMA)
PLB: U1.38(PC7) U10.7(PWMB)
PLC: U1.39(PC8) U10.8(PWMC)
PRA: U1.58(PB6) U11.6(PWMA)
PRB: U1.59(PB7) U11.7(PWMB)
PRC: U1.61(PB8) U11.8(PWMC)
RE: U1.62(PB9) U11.3(ENA) U11.4(ENB) U11.5(ENC)
RESET: C9.2 DEBUG.4 R1.1 RESET.2 U1.7(NRST)
SCL: R12.1 U1.35(PB14) U4.P$13(SCL)
SCL_E: R51.2 U1.56(PB4) U14.1(SCL)
SDA: R11.1 U1.36(PB15) U4.P$14(SDA)
SDA_E: R52.2 U1.57(PB5) U14.3(SDA)
SWCLK: DEBUG.8 U1.49(PA14)
SWDIO: DEBUG.6 U1.46(PA13)
SWO: DEBUG.2 U1.55(PB3)
UART_RX: DEBUG.3 U1.43(PA10)
UART_TX: DEBUG.5 U1.42(PA9)
USB_DN: U1.44(PA11) USB.A7(DN1) USB.B7(DN2)
USB_DP: U1.45(PA12) USB.A6(DP1) USB.B6(DP2)
$1N1644: C8.1 U1.30(VCAP_1)
$1N1647: LED1.2(C) R4.1
$1N1648: LED1.3(C) R5.1
$1N1649: LED1.4(C) R6.1
$1N1777: C83.2 U1.6(PH1-OSC_OUT) X1.1(OSC1)
$1N1778: C82.2 U1.5(PH0-OSC_IN) X1.3(OSC2)
$2N4501: LED11.1(A) R22.1
$2N4505: LED12.1(A) R23.1
$2N4506: LED13.1(A) R24.1
$2N4507: LED14.1(A) R25.1
$2N4532: LED3.1(A) R14.1
$2N4534: LED4.1(A) R15.1
$2N4536: LED5.1(A) R16.1
$2N4538: LED6.1(A) R17.1
$2N4540: LED7.1(A) R18.1
$2N4542: LED8.1(A) R26.1
$2N4544: LED9.1(A) R27.1
$2N4546: LED10.1(A) R28.1
$2N4634: LED3.2(K) LED4.2(K) LED5.2(K) LED6.2(K) LED7.2(K) LED8.2(K) LED9.2(K) LED10.2(K) Q1.3(D)
$2N16121: LED11.2(C) Q2.3(D)
$2N16124: LED14.2(C) Q5.3(D)
$2N16127: LED13.2(C) Q4.3(D)
$2N16130: LED12.2(C) Q3.3(D)
$3N1283: C13.1 U10.21(CP2)
$3N1284: C13.2 U10.20(CP1)
$3N1285: C14.2 U10.14(VG)
$3N1286: C15.2 U10.19(VCP)
$3N1323: C19.1 U11.21(CP2)
$3N1324: C19.2 U11.20(CP1)
$3N1325: C20.2 U11.14(VG)
$3N1326: C21.2 U11.19(VCP)
$4N1009: C62.2 U12.6(BST)
$4N1010: C62.1 L1.1 U12.5(SW)
$4N1027: LED2.2(A) R29.1
$4N1033: R30.1 USB.B5(CC2)
$4N1034: R31.1 USB.A5(CC1)

Not connected (* = marked no-connect by the designer): RESET 1 4; U1 1(VBAT) 2(PC13) 3(PC14-OSC32_IN) 4(PC15-OSC32_OUT) 50(PA15); U4 P$4(INT1) P$9(INT2) P$10(NC1) P$11(NC2); U10 1(nFAULT) 15(SOA) 16(SOB) 17(SOC); U11 1(nFAULT) 15(SOA) 16(SOB) 17(SOC); USB A8(SBU1) B8(SBU2); USER 1 4; X1 2(GND) 4(GND)
